# Altium schematic sheet Beat Box Schematic.SchDoc
size B
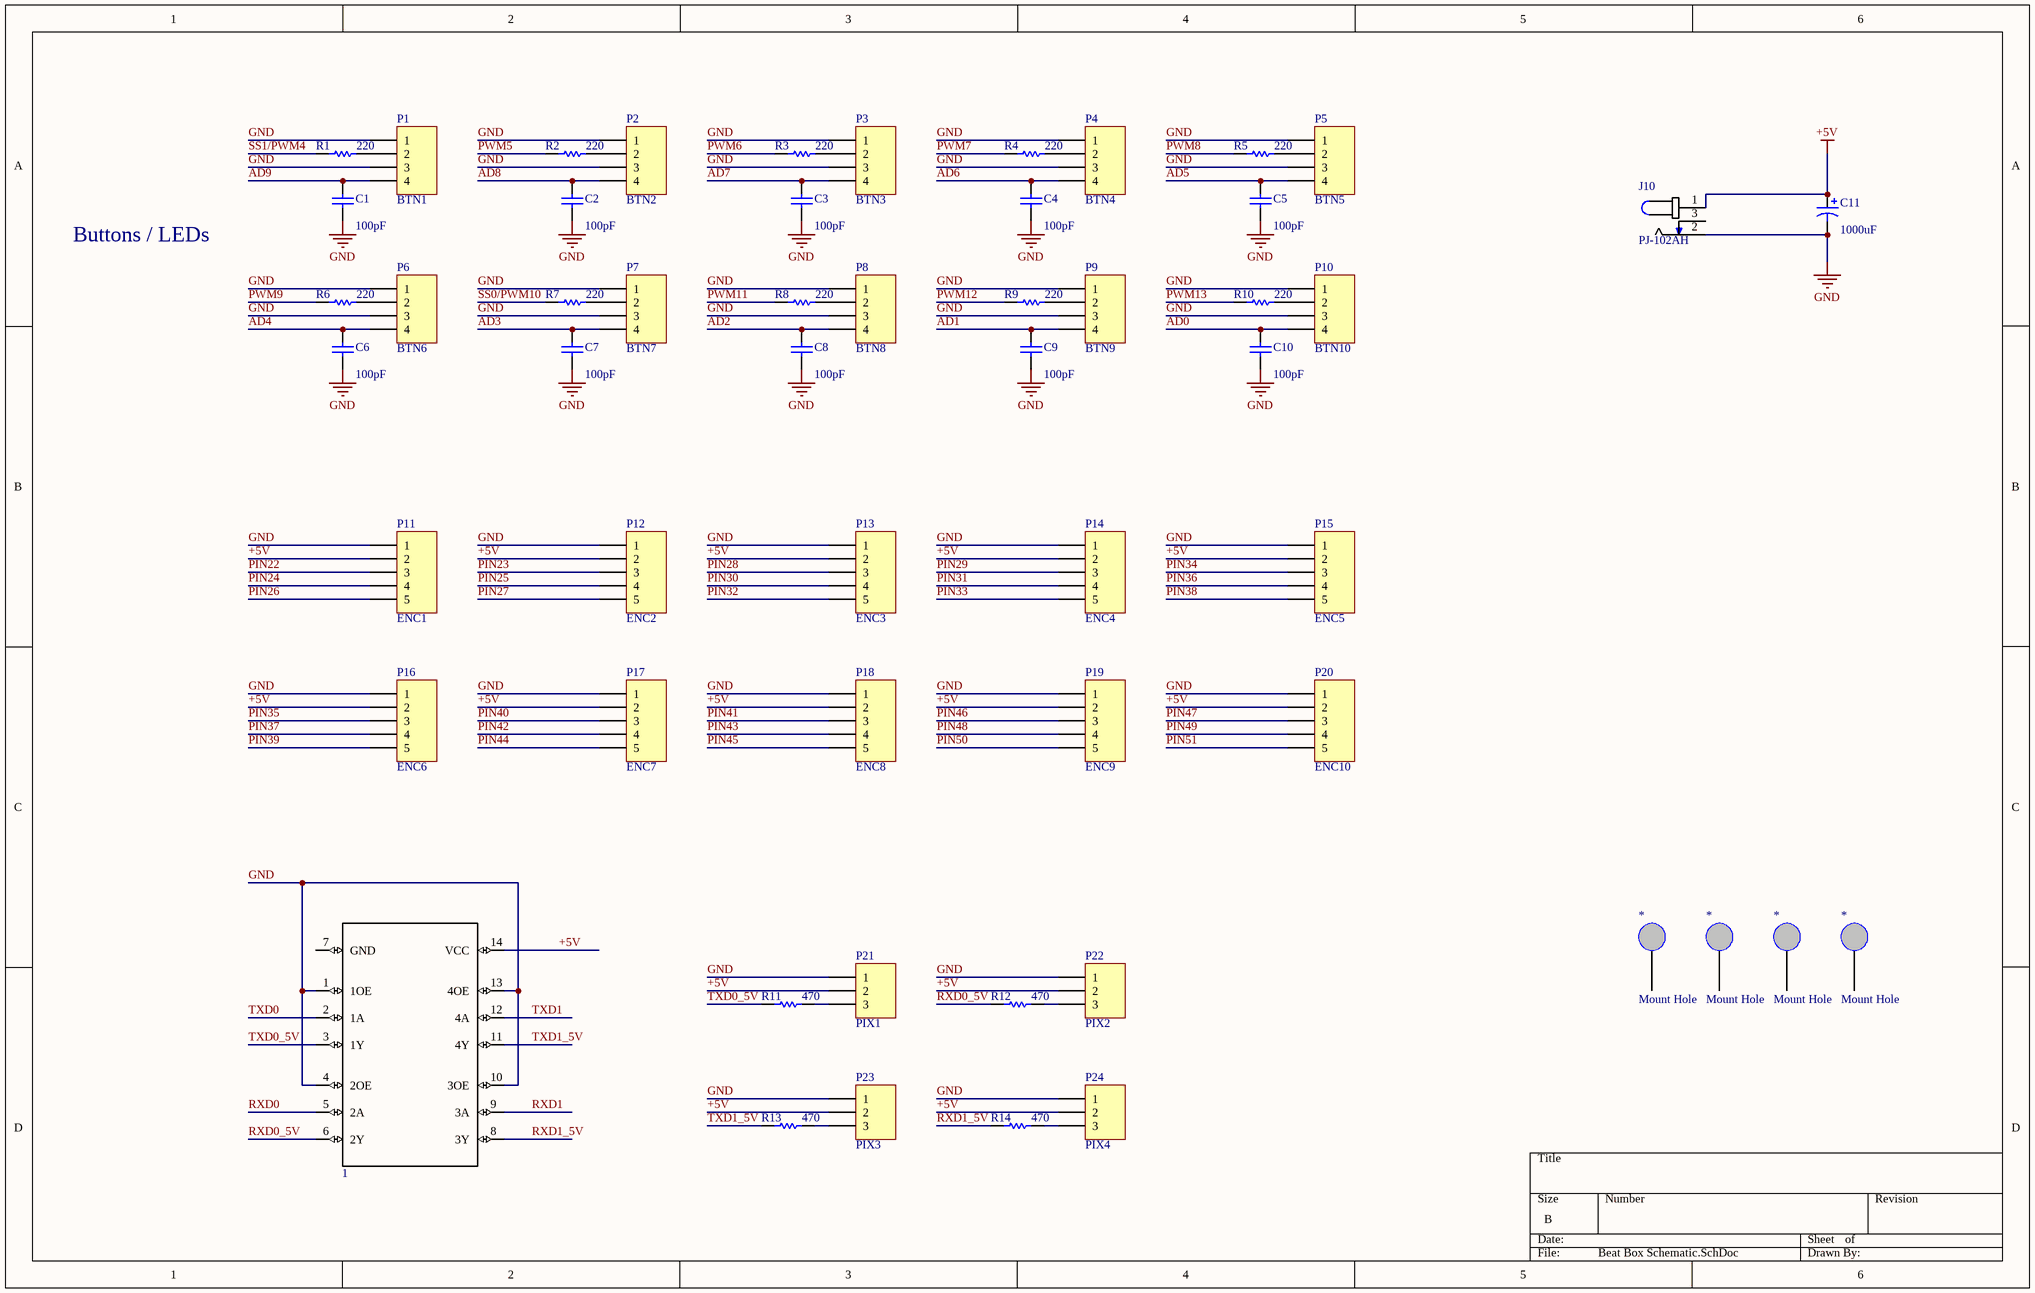
[diagram p0: Beat Box Schematic.SchDoc]

## Parts
(Parts that share a designator on the sheet are numbered #1, #2 ... from top to bottom, then left to right.)
1  74AHC125  [*14DIP]  (value not drawn)
*#1  Mount Hole  [6-32 Mount Hole]
*#2  Mount Hole  [6-32 Mount Hole]
*#3  Mount Hole  [6-32 Mount Hole]
*#4  Mount Hole  [6-32 Mount Hole]
C1  value 100pF  [RAD-0.2]  (hidden comment: Cap)
C2  value 100pF  [RAD-0.2]  (hidden comment: Cap)
C3  value 100pF  [RAD-0.2]  (hidden comment: Cap)
C4  value 100pF  [RAD-0.2]  (hidden comment: Cap)
C5  value 100pF  [RAD-0.2]  (hidden comment: Cap)
C6  value 100pF  [RAD-0.2]  (hidden comment: Cap)
C7  value 100pF  [RAD-0.2]  (hidden comment: Cap)
C8  value 100pF  [RAD-0.2]  (hidden comment: Cap)
C9  value 100pF  [RAD-0.2]  (hidden comment: Cap)
C10  value 100pF  [RAD-0.2]  (hidden comment: Cap)
C11  value 1000uF  [RB7.6-15]  (hidden comment: Cap Pol1)
J10  PJ-102AH  [*CUI_PJ-102AH]
P1  BTN1  [HDR1X4]
P2  BTN2  [HDR1X4]
P3  BTN3  [HDR1X4]
P4  BTN4  [HDR1X4]
P5  BTN5  [HDR1X4]
P6  BTN6  [HDR1X4]
P7  BTN7  [HDR1X4]
P8  BTN8  [HDR1X4]
P9  BTN9  [HDR1X4]
P10  BTN10  [HDR1X4]
P11  ENC1  [HDR1X5]
P12  ENC2  [HDR1X5]
P13  ENC3  [HDR1X5]
P14  ENC4  [HDR1X5]
P15  ENC5  [HDR1X5]
P16  ENC6  [HDR1X5]
P17  ENC7  [HDR1X5]
P18  ENC8  [HDR1X5]
P19  ENC9  [HDR1X5]
P20  ENC10  [HDR1X5]
P21  PIX1  [HDR1X3]
P22  PIX2  [HDR1X3]
P23  PIX3  [HDR1X3]
P24  PIX4  [HDR1X3]
R1  value 220  [AXIAL-0.3]  (hidden comment: Res1)
R2  value 220  [AXIAL-0.3]  (hidden comment: Res1)
R3  value 220  [AXIAL-0.3]  (hidden comment: Res1)
R4  value 220  [AXIAL-0.3]  (hidden comment: Res1)
R5  value 220  [AXIAL-0.3]  (hidden comment: Res1)
R6  value 220  [AXIAL-0.3]  (hidden comment: Res1)
R7  value 220  [AXIAL-0.3]  (hidden comment: Res1)
R8  value 220  [AXIAL-0.3]  (hidden comment: Res1)
R9  value 220  [AXIAL-0.3]  (hidden comment: Res1)
R10  value 220  [AXIAL-0.3]  (hidden comment: Res1)
R11  value 470  [AXIAL-0.3]  (hidden comment: Res1)
R12  value 470  [AXIAL-0.3]  (hidden comment: Res1)
R13  value 470  [AXIAL-0.3]  (hidden comment: Res1)
R14  value 470  [AXIAL-0.3]  (hidden comment: Res1)

## Nets
+5V: 1.14(VCC) C11.1 J10.1 P11.2 P12.2 P13.2 P14.2 P15.2 P16.2 P17.2 P18.2 P19.2 P20.2 P21.2 P22.2 P23.2 P24.2
GND: 1.1(1OE) 1.4(2OE) 1.10(3OE) 1.13(4OE) C1.1 C2.1 C3.1 C4.1 C5.1 C6.1 C7.1 C8.1 C9.1 C10.1 C11.2 J10.2 P1.1 P1.3 P2.1 P2.3 P3.1 P3.3 P4.1 P4.3 P5.1 P5.3 P6.1 P6.3 P7.1 P7.3 P8.1 P8.3 P9.1 P9.3 P10.1 P10.3 P11.1 P12.1 P13.1 P14.1 P15.1 P16.1 P17.1 P18.1 P19.1 P20.1 P21.1 P22.1 P23.1 P24.1
AD0: C10.2 P10.4
AD1: C9.2 P9.4
AD2: C8.2 P8.4
AD3: C7.2 P7.4
AD4: C6.2 P6.4
AD5: C5.2 P5.4
AD6: C4.2 P4.4
AD7: C3.2 P3.4
AD8: C2.2 P2.4
AD9: C1.2 P1.4
PIN22: P11.3
PIN23: P12.3
PIN24: P11.4
PIN25: P12.4
PIN26: P11.5
PIN27: P12.5
PIN28: P13.3
PIN29: P14.3
PIN30: P13.4
PIN31: P14.4
PIN32: P13.5
PIN33: P14.5
PIN34: P15.3
PIN35: P16.3
PIN36: P15.4
PIN37: P16.4
PIN38: P15.5
PIN39: P16.5
PIN40: P17.3
PIN41: P18.3
PIN42: P17.4
PIN43: P18.4
PIN44: P17.5
PIN45: P18.5
PIN46: P19.3
PIN47: P20.3
PIN48: P19.4
PIN49: P20.4
PIN50: P19.5
PIN51: P20.5
PWM5: R2.1
PWM6: R3.1
PWM7: R4.1
PWM8: R5.1
PWM9: R6.1
PWM11: R8.1
PWM12: R9.1
PWM13: R10.1
RXD0: 1.5(2A)
RXD0_5V: 1.6(2Y) R12.1
RXD1: 1.9(3A)
RXD1_5V: 1.8(3Y) R14.1
SS0/PWM10: R7.1
SS1/PWM4: R1.1
TXD0: 1.2(1A)
TXD0_5V: 1.3(1Y) R11.1
TXD1: 1.12(4A)
TXD1_5V: 1.11(4Y) R13.1
NetP1_2: P1.2 R1.2
NetP2_2: P2.2 R2.2
NetP3_2: P3.2 R3.2
NetP4_2: P4.2 R4.2
NetP5_2: P5.2 R5.2
NetP6_2: P6.2 R6.2
NetP7_2: P7.2 R7.2
NetP8_2: P8.2 R8.2
NetP9_2: P9.2 R9.2
NetP10_2: P10.2 R10.2
NetP21_3: P21.3 R11.2
NetP22_3: P22.3 R12.2
NetP23_3: P23.3 R13.2
NetP24_3: P24.3 R14.2

Not connected (* = marked no-connect by the designer): 1 7(GND); *#1 0; *#2 0; *#3 0; *#4 0; J10 3

## Notes on the sheet
- Buttons / LEDs

## Library data of the parts
1 = 74AHC125: MF: Texas Instruments; Package: TSSOP-14 Texas Instruments; MP: 74AHC125; SnapEDA_Link: https://www.snapeda.com/parts/74AHC125/Texas%20Instruments/view-part/?ref=snap; Price: None; Availability: Unavailable; Value: *
C1-C10 = Cap: Capacitor; Published: 8-Jun-2000; LatestRevisionDate: 17-Jul-2002; LatestRevisionNote: Re-released for DXP Platform.; PackageReference: RAD-0.3; Publisher: Altium Limited; PackageDescription: Radial Cap, Thru-Hole; 2 Leads; 0.3 in Pin Spacing
C11 = Cap Pol1: Polarized Capacitor (Radial); Published: 8-Jun-2000; LatestRevisionDate: 17-Jul-2002; LatestRevisionNote: Re-released for DXP Platform.; PackageReference: RB7.6-15; Publisher: Altium Limited; PackageDescription: Polarized Capacitor (Radial); 2 Leads
P1-P10 = Header 4: Header, 4-Pin; LatestRevisionDate: 17-Jul-2002; LatestRevisionNote: Re-released for DXP Platform.; Publisher: Altium Limited
P11-P20 = Header 5: Header, 5-Pin; LatestRevisionDate: 17-Jul-2002; LatestRevisionNote: Re-released for DXP Platform.; Publisher: Altium Limited
P21-P24 = Header 3: Header, 3-Pin; LatestRevisionDate: 17-Jul-2002; LatestRevisionNote: Re-released for DXP Platform.; Publisher: Altium Limited
R1-R14 = Res1: Resistor; Published: 8-Jun-2000; LatestRevisionDate: 17-Jul-2002; LatestRevisionNote: Re-released for DXP Platform.; PackageReference: AXIAL-0.3; Publisher: Altium Limited; PackageDescription: Axial Device, Thru-Hole; 2 Leads; 0.3 in Pin Spacing
J10 = PJ-102AH: Value: *